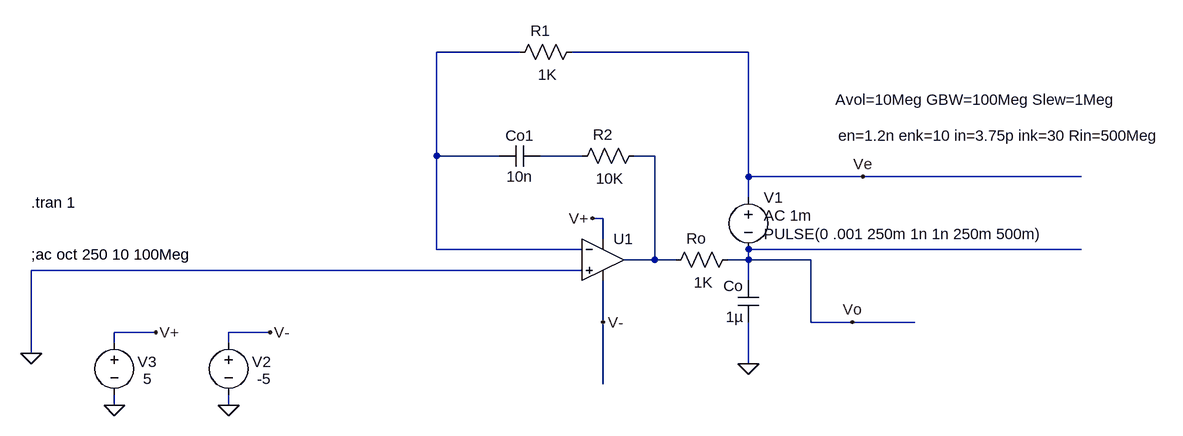
[diagram p0: schematic OpenloopBode.asc]
OpenloopBode.asc, the LTspice schematic file:
Version 4
SHEET 1 1928 1456
WIRE -5056 -3376 -5184 -3376
WIRE -4704 -3376 -4976 -3376
WIRE -5184 -3216 -5184 -3376
WIRE -5088 -3216 -5184 -3216
WIRE -4960 -3216 -5024 -3216
WIRE -4848 -3216 -4880 -3216
WIRE -4704 -3184 -4704 -3376
WIRE -4528 -3184 -4704 -3184
WIRE -4192 -3184 -4528 -3184
WIRE -4704 -3152 -4704 -3184
WIRE -4928 -3120 -4944 -3120
WIRE -4928 -3088 -4928 -3120
WIRE -5184 -3072 -5184 -3216
WIRE -4960 -3072 -5184 -3072
WIRE -4192 -3072 -4704 -3072
WIRE -4848 -3056 -4848 -3216
WIRE -4848 -3056 -4896 -3056
WIRE -4816 -3056 -4848 -3056
WIRE -4704 -3056 -4704 -3072
WIRE -4704 -3056 -4736 -3056
WIRE -4608 -3056 -4704 -3056
WIRE -4960 -3040 -5808 -3040
WIRE -4704 -3024 -4704 -3056
WIRE -4928 -2960 -4928 -3024
WIRE -4608 -2960 -4608 -3056
WIRE -4544 -2960 -4608 -2960
WIRE -4448 -2960 -4544 -2960
WIRE -5616 -2944 -5680 -2944
WIRE -5440 -2944 -5504 -2944
WIRE -5680 -2928 -5680 -2944
WIRE -5504 -2928 -5504 -2944
WIRE -5808 -2912 -5808 -3040
WIRE -4704 -2896 -4704 -2960
WIRE -4928 -2864 -4928 -2960
WIRE -5680 -2832 -5680 -2848
WIRE -5504 -2832 -5504 -2848
FLAG -5808 -2912 0
FLAG -4944 -3120 V+
FLAG -5616 -2944 V+
FLAG -5680 -2832 0
FLAG -4704 -2896 0
FLAG -5440 -2944 V-
FLAG -5504 -2832 0
FLAG -4928 -2960 V-
FLAG -4544 -2960 Vo
FLAG -4528 -3184 Ve
SYMBOL Opamps\\UniversalOpamp2 -4928 -3056 R0
WINDOW 123 358 -247 Left 2
WINDOW 40 362 -191 Left 2
SYMATTR Value2 Avol=10Meg GBW=100Meg Slew=1Meg
SYMATTR SpiceLine2 en=1.2n enk=10 in=3.75p ink=30 Rin=500Meg
SYMATTR InstName U1
SYMBOL voltage -5680 -2944 R0
WINDOW 0 36 45 Left 2
WINDOW 3 44 71 Left 2
WINDOW 123 0 0 Left 2
WINDOW 39 0 0 Left 2
SYMATTR InstName V3
SYMATTR Value 5
SYMBOL res -4960 -3392 R90
WINDOW 0 -1 64 VBottom 2
WINDOW 3 35 53 VTop 2
SYMATTR InstName R1
SYMATTR Value 1K
SYMBOL cap -4688 -3024 M0
SYMATTR InstName Co
SYMATTR Value 1µ
SYMBOL res -4720 -3072 R90
WINDOW 0 -1 64 VBottom 2
WINDOW 3 35 53 VTop 2
SYMATTR InstName Ro
SYMATTR Value 1K
SYMBOL voltage -5504 -2944 R0
WINDOW 0 36 45 Left 2
WINDOW 3 44 71 Left 2
WINDOW 123 0 0 Left 2
WINDOW 39 0 0 Left 2
SYMATTR InstName V2
SYMATTR Value -5
SYMBOL voltage -4704 -3168 R0
WINDOW 123 24 44 Left 2
WINDOW 39 0 0 Left 2
WINDOW 3 24 72 Left 2
SYMATTR Value2 AC 1m
SYMATTR Value PULSE(0 .001 250m 1n 1n 250m 500m)
SYMATTR InstName V1
SYMBOL res -4864 -3232 R90
WINDOW 0 -1 64 VBottom 2
WINDOW 3 35 53 VTop 2
SYMATTR InstName R2
SYMATTR Value 10K
SYMBOL cap -5024 -3200 M270
WINDOW 0 32 32 VTop 2
WINDOW 3 0 32 VBottom 2
SYMATTR InstName Co1
SYMATTR Value 10n
TEXT -5808 -3064 Left 2 !;ac oct 250 10 100Meg
TEXT -5808 -3144 Left 2 !.tran 1

The netlist it stands for:
* OpenloopBode.asc
XU1 0 N001 V+ V- N003 level.2 Avol=10Meg GBW=100Meg Slew=1Meg ilimit=25m rail=0 Vos=0 phimargin=45 en=1.2n enk=10 in=3.75p ink=30 Rin=500Meg  ; pins IN+ IN- V+ V- OUT
V3 V+ 0 5
R1 Ve N001 1K
Co Vo 0 1µ
Ro Vo N003 1K
V2 V- 0 -5
V1 Ve Vo PULSE(0 .001 250m 1n 1n 250m 500m) AC 1m
R2 N003 N002 10K
Co1 N002 N001 10n
;ac oct 250 10 100Meg
.tran 1
.lib UniversalOpamps2.sub
.backanno
.end